# Altium project PCB_BO.PrjPcb
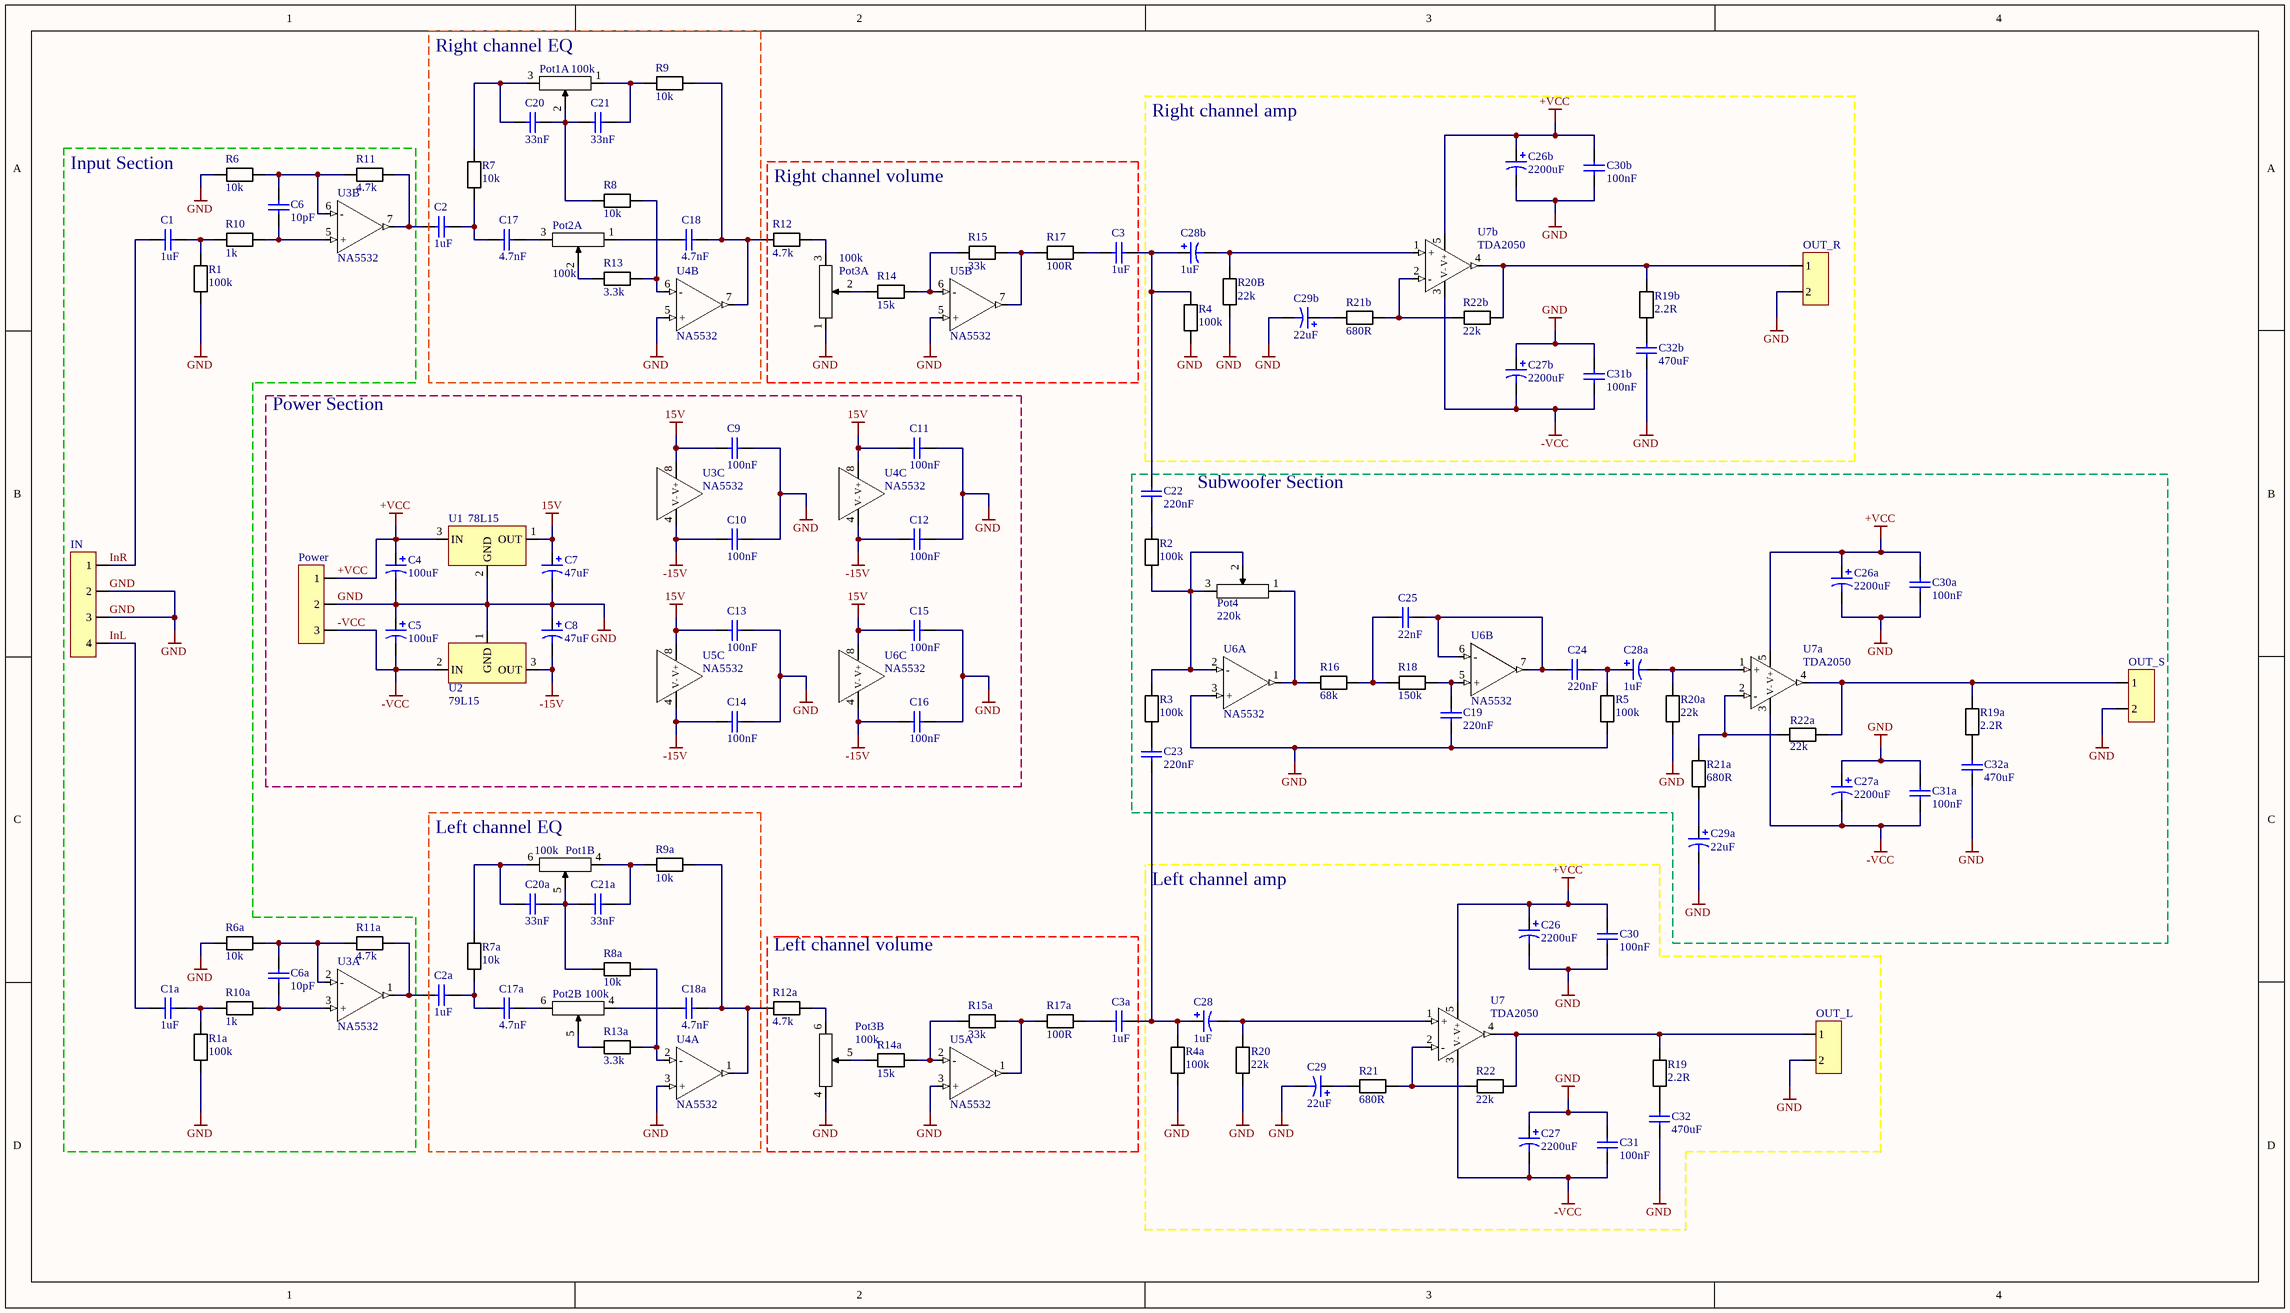
[diagram p0: SCH_BO.SchDoc]
1 sheet, 115 parts. Net scope: global (net labels, ports and power ports of the same name join across sheets).
Board file: PADS_1.PcbDoc

## Sheet SCH_BO.SchDoc: Wzmacniacz stereofonicznyz subwooferem
size 444 x 254 mm; Date: 11; ApprovedBy: 1; CheckedBy: 1; Author: 1; CompanyName: 1; DrawnBy: Bartosz Ostrowski; Engineer: 1; Organization: 1; Address1: 1; Address2: 1; Address3: 1; Address4: 1; DocumentNumber: 1; Revision: 1; SheetTotal: 1; CurrentTime: 1; CurrentDate: 1; DocumentFullPathAndName: *1; DocumentName: 1; ModifiedDate: 1; ImagePath: 1; ProjectName: 1; Application_BuildNumber: 1

### Parts
C1  value 1uF  [CAP SMD 3.2x1.6x1.6]  (hidden comment: Capacitor)
C1a  value 1uF  [CAP SMD 3.2x1.6x1.6]  (hidden comment: Capacitor)
C2  value 1uF  [CAP SMD 3.2x1.6x1.6]  (hidden comment: Capacitor)
C2a  value 1uF  [CAP SMD 3.2x1.6x1.6]  (hidden comment: Capacitor)
C3  value 1uF  [CAP SMD 3.2x1.6x1.6]  (hidden comment: Capacitor)
C3a  value 1uF  [CAP SMD 3.2x1.6x1.6]  (hidden comment: Capacitor)
C4  value 100uF  [CAP_POL_SMD_8.5x8.5x10.7]  (hidden comment: Capacitor_Pol)
C5  value 100uF  [CAP_POL_SMD_8.5x8.5x10.7]  (hidden comment: Capacitor_Pol)
C6  value 10pF  [CAP SMD 2x1.25x1.25]  (hidden comment: Capacitor)
C6a  value 10pF  [CAP SMD 2x1.25x1.25]  (hidden comment: Capacitor)
C7  value 47uF  [CAP_POL_SMD_6.8x6.8x8]  (hidden comment: Capacitor_Pol)
C8  value 47uF  [CAP_POL_SMD_6.8x6.8x8]  (hidden comment: Capacitor_Pol)
C9  value 100nF  [CAP SMD 2x1.25x1.25]  (hidden comment: Capacitor)
C10  value 100nF  [CAP SMD 2x1.25x1.25]  (hidden comment: Capacitor)
C11  value 100nF  [CAP SMD 2x1.25x1.25]  (hidden comment: Capacitor)
C12  value 100nF  [CAP SMD 2x1.25x1.25]  (hidden comment: Capacitor)
C13  value 100nF  [CAP SMD 2x1.25x1.25]  (hidden comment: Capacitor)
C14  value 100nF  [CAP SMD 2x1.25x1.25]  (hidden comment: Capacitor)
C15  value 100nF  [CAP SMD 2x1.25x1.25]  (hidden comment: Capacitor)
C16  value 100nF  [CAP SMD 2x1.25x1.25]  (hidden comment: Capacitor)
C17  value 4.7nF  [CAP SMD 2x1.25x1.25]  (hidden comment: Capacitor)
C17a  value 4.7nF  [CAP SMD 2x1.25x1.25]  (hidden comment: Capacitor)
C18  value 4.7nF  [CAP SMD 2x1.25x1.25]  (hidden comment: Capacitor)
C18a  value 4.7nF  [CAP SMD 2x1.25x1.25]  (hidden comment: Capacitor)
C19  value 220nF  [CAP SMD 2x1.25x1.25]  (hidden comment: Capacitor)
C20  value 33nF  [CAP SMD 2x1.25x1.25]  (hidden comment: Capacitor)
C20a  value 33nF  [CAP SMD 2x1.25x1.25]  (hidden comment: Capacitor)
C21  value 33nF  [CAP SMD 2x1.25x1.25]  (hidden comment: Capacitor)
C21a  value 33nF  [CAP SMD 2x1.25x1.25]  (hidden comment: Capacitor)
C22  value 220nF  [CAP SMD 2x1.25x1.25]  (hidden comment: Capacitor)
C23  value 220nF  [CAP SMD 2x1.25x1.25]  (hidden comment: Capacitor)
C24  value 220nF  [CAP SMD 2x1.25x1.25]  (hidden comment: Capacitor)
C25  value 22nF  [CAP SMD 2x1.25x1.25]  (hidden comment: Capacitor)
C26  value 2200uF  [Panasonic_K16_BO]  (hidden comment: Capacitor_Pol)
C26a  value 2200uF  [Panasonic_K16_BO]  (hidden comment: Capacitor_Pol)
C26b  value 2200uF  [Panasonic_K16_BO]  (hidden comment: Capacitor_Pol)
C27  value 2200uF  [Panasonic_K16_BO]  (hidden comment: Capacitor_Pol)
C27a  value 2200uF  [Panasonic_K16_BO]  (hidden comment: Capacitor_Pol)
C27b  value 2200uF  [Panasonic_K16_BO]  (hidden comment: Capacitor_Pol)
C28  value 1uF  [CAP_POL_SMD_4.5x4.5x6]  (hidden comment: Capacitor_Pol)
C28a  value 1uF  [CAP_POL_SMD_4.5x4.5x6]  (hidden comment: Capacitor_Pol)
C28b  value 1uF  [CAP_POL_SMD_4.5x4.5x6]  (hidden comment: Capacitor_Pol)
C29  value 22uF  [CAP_POL_SMD_6.8x6.8x6]  (hidden comment: Capacitor_Pol)
C29a  value 22uF  [CAP_POL_SMD_6.8x6.8x6]  (hidden comment: Capacitor_Pol)
C29b  value 22uF  [CAP_POL_SMD_6.8x6.8x6]  (hidden comment: Capacitor_Pol)
C30  value 100nF  [CAP SMD 2x1.25x1.25]  (hidden comment: Capacitor)
C30a  value 100nF  [CAP SMD 2x1.25x1.25]  (hidden comment: Capacitor)
C30b  value 100nF  [CAP SMD 2x1.25x1.25]  (hidden comment: Capacitor)
C31  value 100nF  [CAP SMD 2x1.25x1.25]  (hidden comment: Capacitor)
C31a  value 100nF  [CAP SMD 2x1.25x1.25]  (hidden comment: Capacitor)
C31b  value 100nF  [CAP SMD 2x1.25x1.25]  (hidden comment: Capacitor)
C32  value 470uF  [CAP SMD 2x1.25x1.25]  (hidden comment: Capacitor)
C32a  value 470uF  [CAP SMD 2x1.25x1.25]  (hidden comment: Capacitor)
C32b  value 470uF  [CAP SMD 2x1.25x1.25]  (hidden comment: Capacitor)
IN  (no value)  [quad solder pad]
OUT_L  ?  [double solder pad]  (value not drawn)
OUT_R  ?  [double solder pad]  (value not drawn)
OUT_S  ?  [double solder pad]  (value not drawn)
Pot1  ?  [PDB182-K_BO]  (value not drawn)  (parts A,B of 2)
Pot2  ?  [PDB182-K_BO]  (value not drawn)  (parts A,B of 2)
Pot3  ?  [PDB182-K_BO]  (value not drawn)  (parts A,B of 2)
Pot4  (no value)  [PDB181-K_BO]
Power  ?  [tripple solder pad]  (value not drawn)
R1  value 100k  [RES_SMD_3.1x1.6x0.6]
R1a  value 100k  [RES_SMD_3.1x1.6x0.6]
R2  value 100k  [RES_SMD_3.1x1.6x0.6]
R3  value 100k  [RES_SMD_3.1x1.6x0.6]
R4  value 100k  [RES_SMD_3.1x1.6x0.6]
R4a  value 100k  [RES_SMD_3.1x1.6x0.6]
R5  value 100k  [RES_SMD_3.1x1.6x0.6]
R6  value 10k  [RES_SMD_3.1x1.6x0.6]
R6a  value 10k  [RES_SMD_3.1x1.6x0.6]
R7  value 10k  [RES_SMD_3.1x1.6x0.6]
R7a  value 10k  [RES_SMD_3.1x1.6x0.6]
R8  value 10k  [RES_SMD_3.1x1.6x0.6]
R8a  value 10k  [RES_SMD_3.1x1.6x0.6]
R9  value 10k  [RES_SMD_3.1x1.6x0.6]
R9a  value 10k  [RES_SMD_3.1x1.6x0.6]
R10  value 1k  [RES_SMD_3.1x1.6x0.6]
R10a  value 1k  [RES_SMD_3.1x1.6x0.6]
R11  value 4.7k  [RES_SMD_3.1x1.6x0.6]
R11a  value 4.7k  [RES_SMD_3.1x1.6x0.6]
R12  value 4.7k  [RES_SMD_3.1x1.6x0.6]
R12a  value 4.7k  [RES_SMD_3.1x1.6x0.6]
R13  value 3.3k  [RES_SMD_3.1x1.6x0.6]
R13a  value 3.3k  [RES_SMD_3.1x1.6x0.6]
R14  value 15k  [RES_SMD_3.1x1.6x0.6]
R14a  value 15k  [RES_SMD_3.1x1.6x0.6]
R15  value 33k  [RES_SMD_3.1x1.6x0.6]
R15a  value 33k  [RES_SMD_3.1x1.6x0.6]
R16  value 68k  [RES_SMD_3.1x1.6x0.6]
R17  value 100R  [RES_SMD_3.1x1.6x0.6]
R17a  value 100R  [RES_SMD_3.1x1.6x0.6]
R18  value 150k  [RES_SMD_3.1x1.6x0.6]
R19  value 2.2R  [RES_SMD_3.1x1.6x0.6]
R19a  value 2.2R  [RES_SMD_3.1x1.6x0.6]
R19b  value 2.2R  [RES_SMD_3.1x1.6x0.6]
R20  value 22k  [RES_SMD_3.1x1.6x0.6]
R20a  value 22k  [RES_SMD_3.1x1.6x0.6]
R20B  value 22k  [RES_SMD_3.1x1.6x0.6]
R21  value 680R  [RES_SMD_3.1x1.6x0.6]
R21a  value 680R  [RES_SMD_3.1x1.6x0.6]
R21b  value 680R  [RES_SMD_3.1x1.6x0.6]
R22  value 22k  [RES_SMD_3.1x1.6x0.6]
R22a  value 22k  [RES_SMD_3.1x1.6x0.6]
R22b  value 22k  [RES_SMD_3.1x1.6x0.6]
U1  78L15  [SOT89]
U2  79L15  [SOT89]
U3  NA5532  [SOT96-1]  (parts A,B,C of 3)
U4  NA5532  [SOT96-1]  (parts A,B,C of 3)
U5  NA5532  [SOT96-1]  (parts A,B,C of 3)
U6  NA5532  [SOT96-1]  (parts A,B,C of 3)
U7  TDA2050  [TO-22B_BO]
U7a  TDA2050  [TO-22B_BO]
U7b  TDA2050  [TO-22B_BO]

### Blocks framed on the sheet
Right channel EQ: C2 C17 C18 C20 C21 Pot1 Pot2 R7-R9 R13 U4
Right channel amp: C26b C27b C28b C29b C30b C31b C32b OUT_R R4 R19b R20B R21b R22b U7b
Input Section: C1 C1a C6 C6a IN R1 R1a R6 R6a R10 R10a R11 R11a U3
Right channel volume: C3 Pot3 R12 R14 R15 R17 U5
Power Section: C4 C5 C7-C16 Power U1-U6
Subwoofer Section: C19 C22-C25 C26a C27a C28a C29a C30a C31a C32a OUT_S Pot4 R2 R3 R5 R16 R18 R19a R20a R21a R22a U6 U7a
Left channel EQ: C2a C17a C18a C20a C21a Pot1 Pot2 R7a R8a R9a R13a U4
Left channel amp: C26-C32 OUT_L R4a R19-R22 U7

### Nets
15V: C7.1 C9.1 C11.1 C13.1 C15.1 U1.1(OUT) U3.8(V+) U4.8(V+) U5.8(V+) U6.8(V+)
+VCC: C4.1 C26.1 C26a.1 C26b.1 C30.1 C30a.1 C30b.1 Power.1 U1.3(IN) U7.5(V+) U7a.5(V+) U7b.5(V+)
-15V: C8.2 C10.1 C12.1 C14.1 C16.1 U2.3(OUT) U3.4(V-) U4.4(V-) U5.4(V-) U6.4(V-)
-VCC: C5.2 C27.2 C27a.2 C27b.2 C31.1 C31a.1 C31b.1 Power.3 U2.2(IN) U7.3(V-) U7a.3(V-) U7b.3(V-)
GND: C4.2 C5.1 C7.2 C8.1 C9.2 C10.2 C11.2 C12.2 C13.2 C14.2 C15.2 C16.2 C19.2 C26.2 C26a.2 C26b.2 C27.1 C27a.1 C27b.1 C29.2 C29a.2 C29b.2 C30.2 C30a.2 C30b.2 C31.2 C31a.2 C31b.2 C32.1 C32a.1 C32b.1 IN.2 IN.3 OUT_L.2 OUT_R.2 OUT_S.2 Pot3.1 Pot3.4 Power.2 R1.1(OUT) R1a.1(OUT) R4.2(OUT) R4a.2(OUT) R5.2(OUT) R6.2(OUT) R6a.2(OUT) R20.2(OUT) R20a.2(OUT) R20B.2(OUT) U1.2(GND) U2.1(GND) U4.3(+) U4.5(+) U5.3(+) U5.5(+) U6.3(+)
InL: C1a.1 IN.4
InR: C1.1 IN.1
NetC1_2: C1.2 R1.2(OUT) R10.2(OUT)
NetC1a_2: C1a.2 R1a.2(OUT) R10a.2(OUT)
NetC2_1: C2.1 R11.1(OUT) U3.7
NetC2_2: C2.2 C17.1 R7.2(OUT)
NetC2a_1: C2a.1 R11a.1(OUT) U3.1
NetC2a_2: C2a.2 C17a.1 R7a.2(OUT)
NetC3_1: C3.1 R17.1(OUT)
NetC3_2: C3.2 C22.2 C28b.1 R4.1(OUT)
NetC3a_1: C3a.1 R17a.1(OUT)
NetC3a_2: C3a.2 C23.1 C28.1 R4a.1(OUT)
NetC6_1: C6.1 R10.1(OUT) U3.5(+)
NetC6_2: C6.2 R6.1(OUT) R11.2(OUT) U3.6(-)
NetC6a_1: C6a.1 R10a.1(OUT) U3.3(+)
NetC6a_2: C6a.2 R6a.1(OUT) R11a.2(OUT) U3.2(-)
NetC17_2: C17.2 Pot2.3
NetC17a_2: C17a.2 Pot2.6
NetC18_1: C18.1 Pot2.1
NetC18_2: C18.2 R9.1(OUT) R12.2(OUT) U4.7
NetC18a_1: C18a.1 Pot2.4
NetC18a_2: C18a.2 R9a.1(OUT) R12a.2(OUT) U4.1
NetC19_1: C19.1 R18.1(OUT) U6.5(+)
NetC20_1: C20.1 C21.2 Pot1.2 R8.2(OUT)
NetC20_2: C20.2 Pot1.3 R7.1(OUT)
NetC20a_1: C20a.1 C21a.2 Pot1.5 R8a.2(OUT)
NetC20a_2: C20a.2 Pot1.6 R7a.1(OUT)
NetC21_1: C21.1 Pot1.1 R9.2(OUT)
NetC21a_1: C21a.1 Pot1.4 R9a.2(OUT)
NetC22_1: C22.1 R2.1(OUT)
NetC23_2: C23.2 R3.2(OUT)
NetC24_1: C24.1 C25.2 U6.6(-) U6.7
NetC24_2: C24.2 C28a.1 R5.1(OUT)
NetC25_1: C25.1 R16.1(OUT) R18.2(OUT)
NetC28_2: C28.2 R20.1(OUT) U7.1(+)
NetC28a_2: C28a.2 R20a.1(OUT) U7a.1(+)
NetC28b_2: C28b.2 R20B.1(OUT) U7b.1(+)
NetC29_1: C29.1 R21.2(OUT)
NetC29a_1: C29a.1 R21a.2(OUT)
NetC29b_1: C29b.1 R21b.2(OUT)
NetC32_2: C32.2 R19.1(OUT)
NetC32a_2: C32a.2 R19a.1(OUT)
NetC32b_2: C32b.2 R19b.1(OUT)
NetOUT_L_1: OUT_L.1 R19.2(OUT) R22.1(OUT) U7.4
NetOUT_R_1: OUT_R.1 R19b.2(OUT) R22b.1(OUT) U7b.4
NetOUT_S_1: OUT_S.1 R19a.2(OUT) R22a.2(OUT) U7a.4
NetPot2_2: Pot2.2 R13.2(OUT)
NetPot2_5: Pot2.5 R13a.2(OUT)
NetPot3_2: Pot3.2 R14.2(OUT)
NetPot3_3: Pot3.3 R12.1(OUT)
NetPot3_5: Pot3.5 R14a.2(OUT)
NetPot3_6: Pot3.6 R12a.1(OUT)
NetPot4_1: Pot4.1 R16.2(OUT) U6.1
NetPot4_2: Pot4.2 Pot4.3 R2.2(OUT) R3.1(OUT) U6.2(-)
NetR8_1: R8.1(OUT) R13.1(OUT) U4.6(-)
NetR8a_1: R8a.1(OUT) R13a.1(OUT) U4.2(-)
NetR14_1: R14.1(OUT) R15.2(OUT) U5.6(-)
NetR14a_1: R14a.1(OUT) R15a.2(OUT) U5.2(-)
NetR15_1: R15.1(OUT) R17.2(OUT) U5.7
NetR15a_1: R15a.1(OUT) R17a.2(OUT) U5.1
NetR21_1: R21.1(OUT) R22.2(OUT) U7.2(-)
NetR21a_1: R21a.1(OUT) R22a.1(OUT) U7a.2(-)
NetR21b_1: R21b.1(OUT) R22b.2(OUT) U7b.2(-)

### Notes on the sheet
- Left channel volume
- (in symbol BOURNS_PDB181-K) 220k
- (in symbol BOURNS_PDB182-K, part A) 100k
- (in symbol BOURNS_PDB182-K, part B) 100k

### Library data of the parts
IN = Quad solder pad
OUT_L OUT_R OUT_S = Double solder pad
Pot1-Pot3 = BOURNS_PDB182-K
Pot4 = BOURNS_PDB181-K
Power = Tripple solder pad
R1 R1a R2-R4 R4a R5 R6 R6a R7 R7a R8 R8a R9 R9a R10 R10a R11 R11a R12 R12a R13 R13a R14 R14a R15 R15a R16 R17 R17a R18 R19 R19a R19b R20 R20a R20B R21 R21a R21b R22 R22a R22b = Res1: Resistor; Published: 8-Jun-2000; LatestRevisionDate: 17-Jul-2002; LatestRevisionNote: Re-released for DXP Platform.; PackageReference: AXIAL-0.3; Publisher: Altium Limited; PackageDescription: Axial Device, Thru-Hole; 2 Leads; 0.3 in Pin Spacing